# EAGLE design Project I (EAGLE 9.5.1)
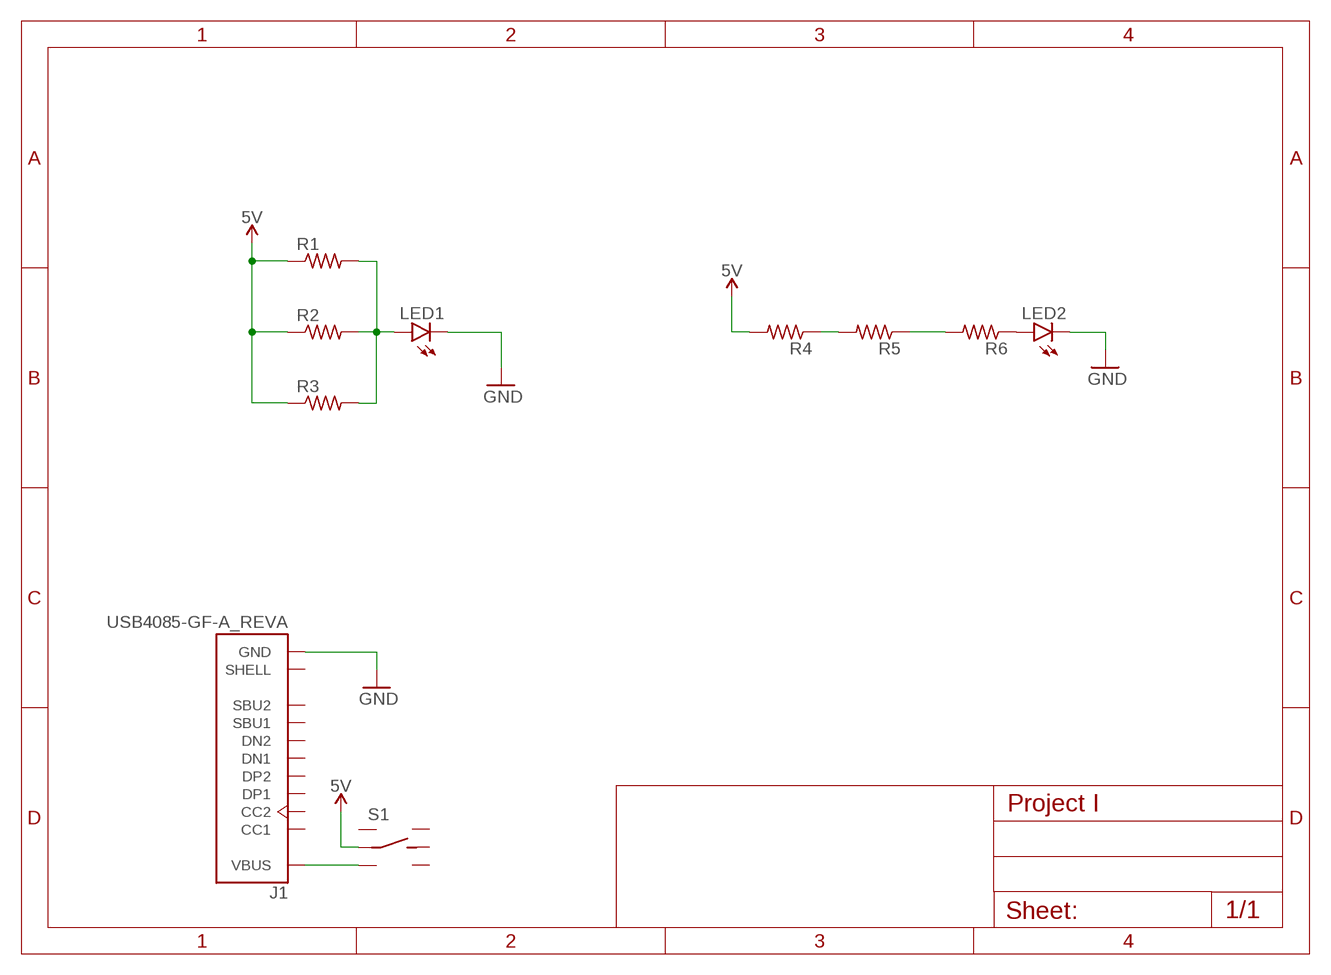
[diagram p0: schematic, sheet 1]

## Parts
J1  USB4085-GF-A_REVA  [GCT_USB4085-GF-A_REVA]
LED1  LED5MM  [LED5MM]
LED2  LED5MM  [LED5MM]
R1  R-US_0204/7  [0204/7]
R2  R-US_0204/7  [0204/7]
R3  R-US_0204/7  [0204/7]
R4  R-US_0204/7  [0204/7]
R5  R-US_0204/7  [0204/7]
R6  R-US_0204/7  [0204/7]
S1  DPDT_JS202011CQN  [DPDT_JS202011CQN]

## Nets
5V: R1.1 R2.1 R3.1 R4.2 S1.2(LC)
GND: J1.A1(GND) J1.A12(GND) J1.B1(GND) J1.B12(GND) LED1.K(C) LED2.K(C)
N$1: R4.1 R5.2
N$2: R5.1 R6.2
N$3: LED1.A R1.2 R2.2 R3.2
N$4: LED2.A R6.1
N$5: J1.A4(VBUS) J1.A9(VBUS) J1.B4(VBUS) J1.B9(VBUS) S1.3(L2)
Unconnected: J1.A5(CC1) J1.A6(DP1) J1.A7(DN1) J1.A8(SBU1) J1.B5(CC2) J1.B6(DP2) J1.B7(DN2) J1.B8(SBU2) J1.P1(SHELL) J1.P2(SHELL) J1.P3(SHELL) J1.P4(SHELL) S1.1(L1) S1.4(R1) S1.5(RC) S1.6(R2)

## Library data of the parts
J1 = SpaceDIY_connectors:USB4085-GF-A_REVA
LED1 LED2 = led:LED: LED OSRAM: - CHIPLED LG R971, LG N971, LY N971, LG Q971, LY Q971, LO R971, LY R971 LH N974, LH R974 LS Q976, LO Q976, LY Q976 LO Q996 - Hyper CHIPLED LW Q18S LB Q993, LB Q99A, LB R99A - SideLED LS A670, LO A670, LY A670, LG A670, LP A670 LB A673, LV A673, LT A673, LW A673 LH A674 LY A675 LS A676, LA A676, LO A676, LY A676, LW A676 LS A679, LY A679, LG A679 - Hyper Micro SIDELED® LS Y876, LA Y876, LO Y876, LY Y876 LT Y87S - SmartLED LW L88C, LW L88S LB L89C, LB L89S, LG L890 LS L89K, LO L89K, LY L89K LS L896, LA L896, LO L896, LY L896 - TOPLED LS T670, LO T670, LY T670, LG T670, LP T670 LSG T670, LSP T670, LSY T670, LOP T670, LYG T670 LG T671, LOG T671, LSG T671 LB T673, LV T673, LT T673, LW T673 LH T674 LS T676, LA T676, LO T676, LY T676, LB T676, LH T676, LSB T676, LW T676 LB T67C, LV T67C, LT T67C, LS T67K, LO T67K, LY T67K, LW E67C LS E67B, LA E67B, LO E67B, LY E67B, LB E67C, LV E67C, LT E67C LW T67C LS T679, LY T679, LG T679 LS T770, LO T770, LY T770, LG T770, LP T770 LB T773, LV T773, LT T773, LW T773 LH T774 LS E675, LA E675, LY E675, LS T675 LS T776, LA T776, LO T776, LY T776, LB T776 LHGB T686 LT T68C, LB T68C - Hyper Mini TOPLED® LB M676 - Mini TOPLED Santana® LG M470 LS M47K, LO M47K, LY M47K Source: http://www.osram.convergy.de LUXEON: - LUMILED® LXK2-PW12-R00, LXK2-PW12-S00, LXK2-PW14-U00, LXK2-PW14-V00 LXK2-PM12-R00, LXK2-PM12-S00, LXK2-PM14-U00 LXK2-PE12-Q00, LXK2-PE12-R00, LXK2-PE12-S00, LXK2-PE14-T00, LXK2-PE14-U00 LXK2-PB12-K00, LXK2-PB12-L00, LXK2-PB12-M00, LXK2-PB14-N00, LXK2-PB14-P00, LXK2-PB14-Q00 LXK2-PR12-L00, LXK2-PR12-M00, LXK2-PR14-Q00, LXK2-PR14-R00 LXK2-PD12-Q00, LXK2-PD12-R00, LXK2-PD12-S00 LXK2-PH12-R00, LXK2-PH12-S00 LXK2-PL12-P00, LXK2-PL12-Q00, LXK2-PL12-R00 Source: www.luxeon.com KINGBRIGHT: KA-3528ASYC Source: www.kingbright.com
R1-R6 = rcl:R-US_: RESISTOR, American symbol; SPICEPREFIX: R
S1 = bt_electromech:DPDT: Dual Position, Dual Throw (DPDT) Switch

## Board
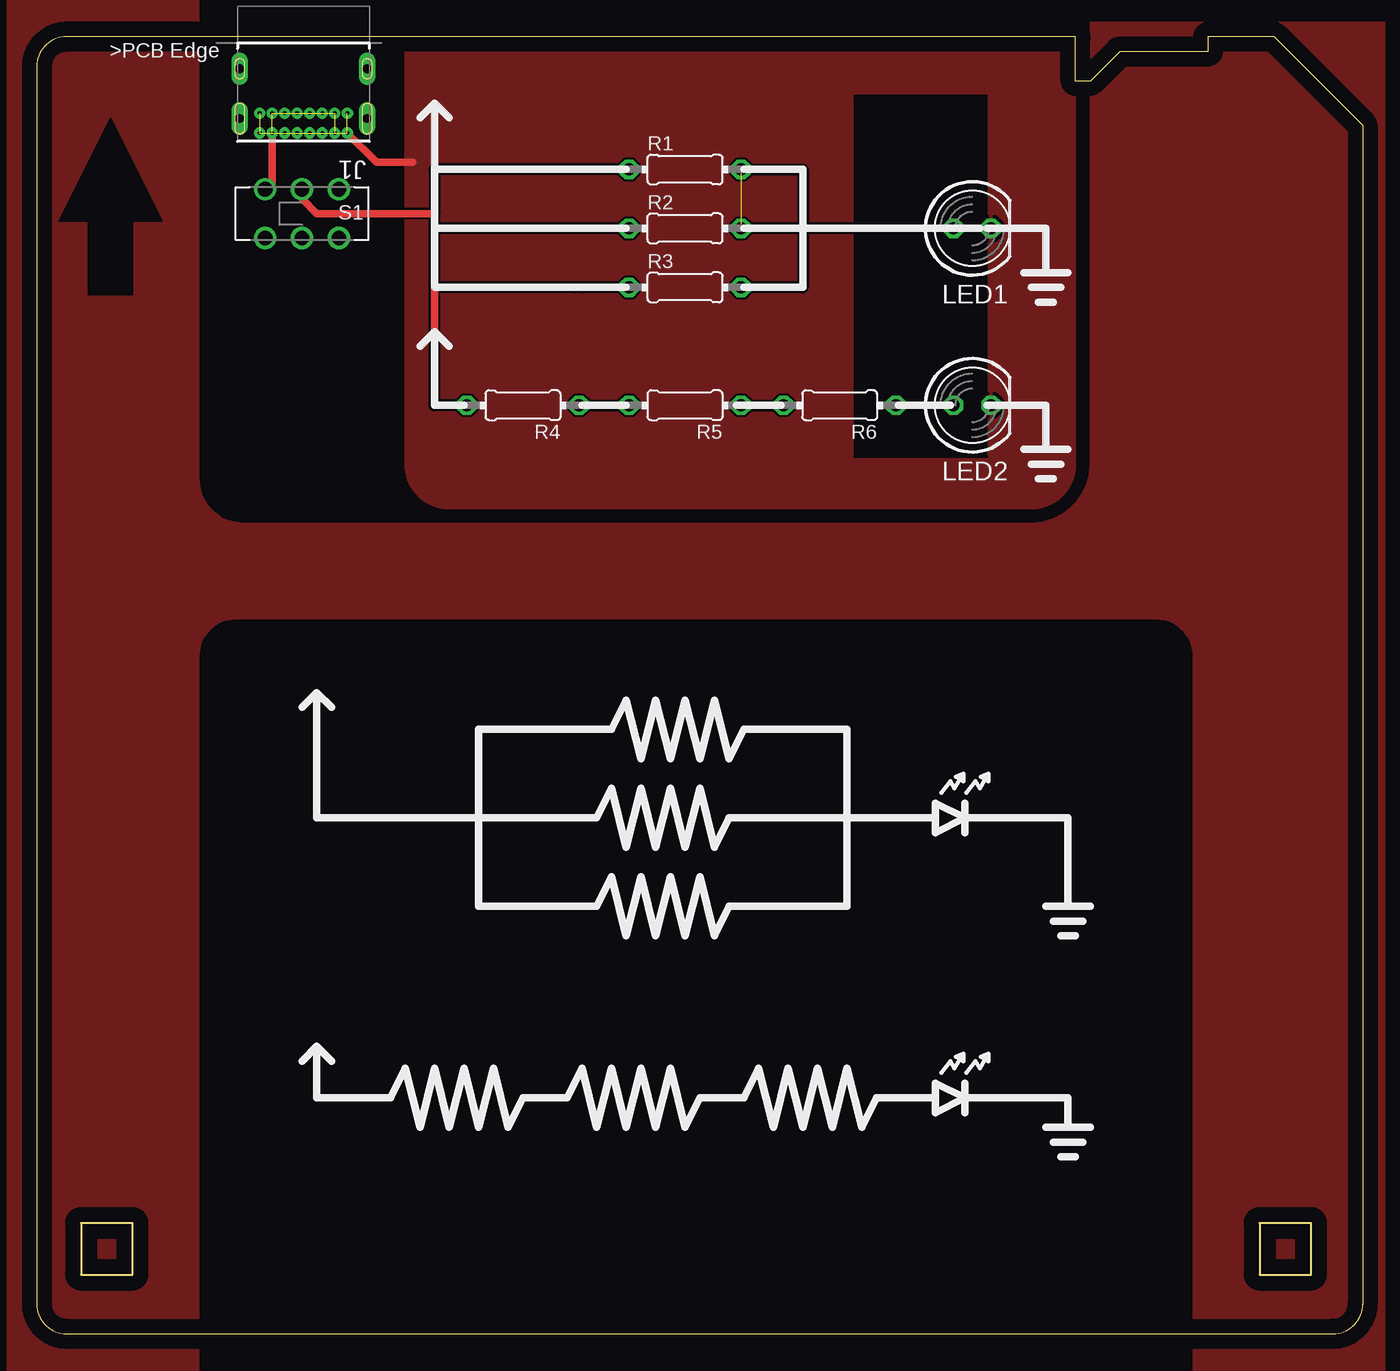
[diagram p1: board, top side]
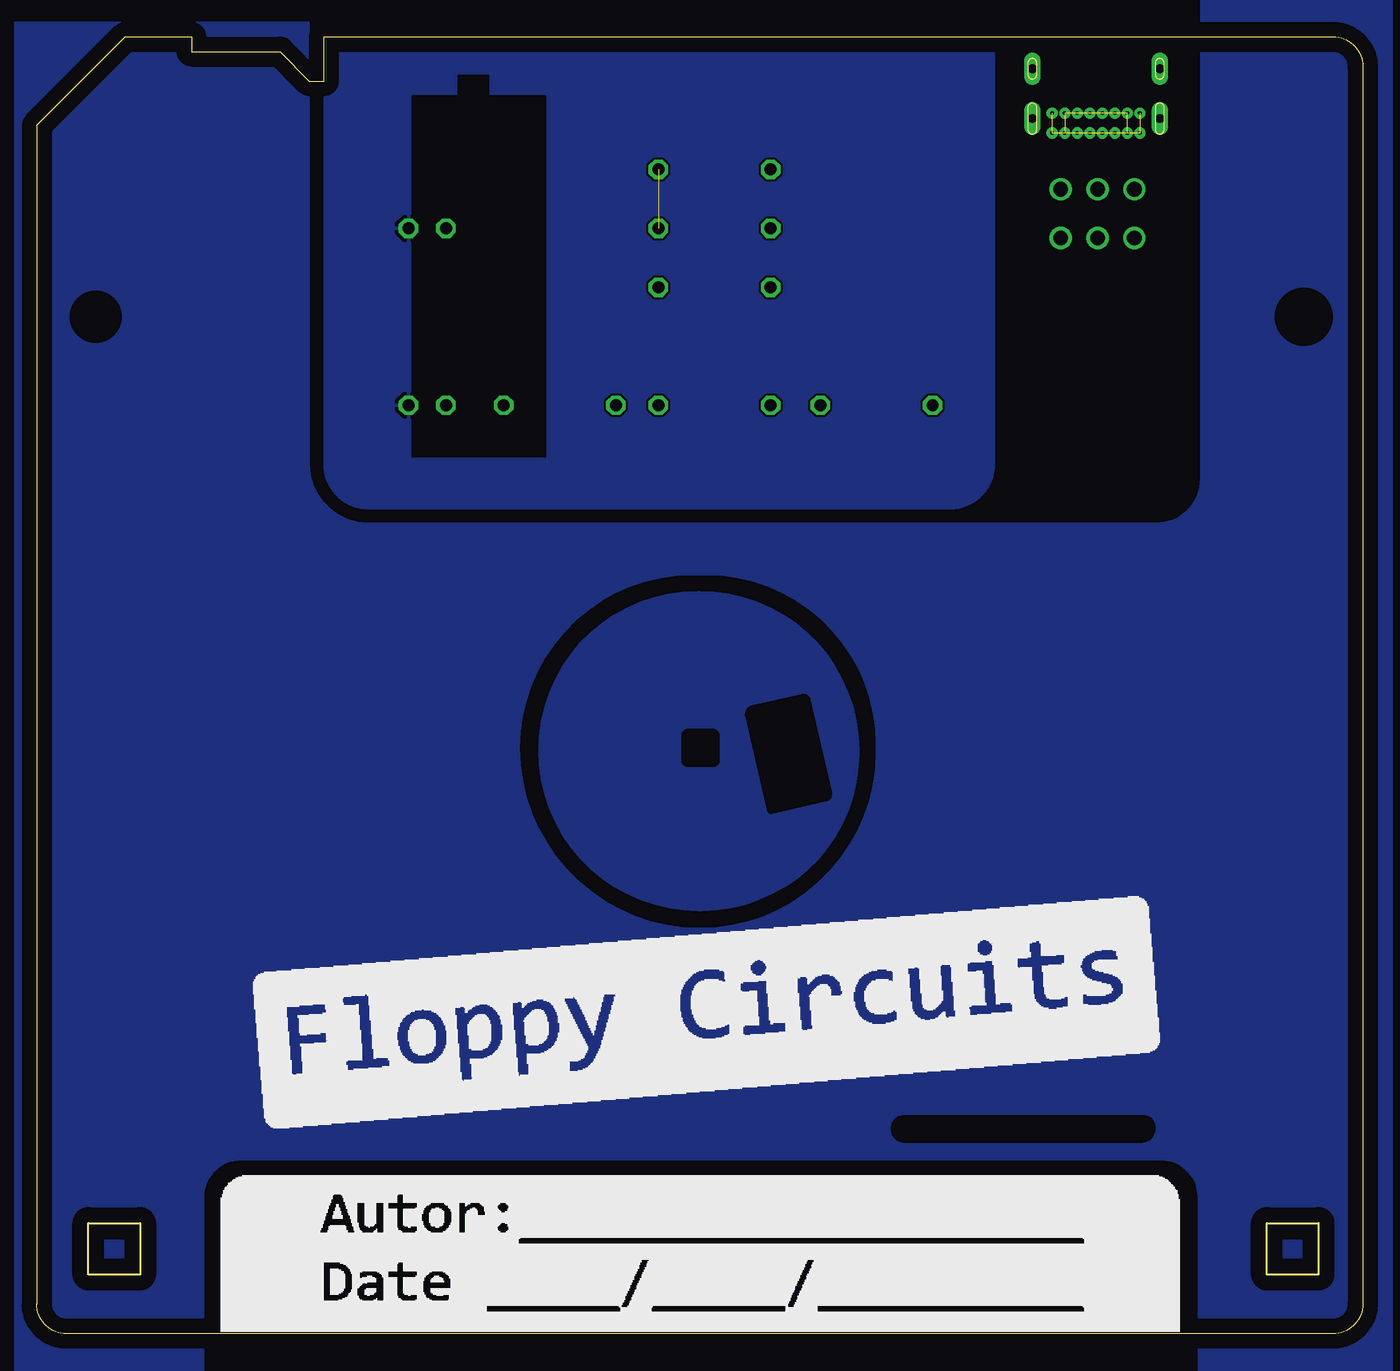
[diagram p2: board, bottom side, seen from below]

Size 90 x 88 mm. Coordinates in mm from the lower left corner, seen from the top.
Outline: 0,2 arc90 2,0 88,0 arc90 90,2 90,82 84,88 79.5,88 79.5,87 73.5,87 71.5,85 70.5,85 70.5,88 2,88 arc90 0,86 0,2
Outline: 3,4 6.5,4 6.5,7.5 3,7.5 3,4
Outline: 83,4 86.5,4 86.5,7.5 83,7.5 83,4
Copper layers (1*16): Top 0.035mm / dielectric 1.5mm / Bottom 0.035mm
Design rules "default *": minimum track width 6mil, minimum drill 0.35mm, track to track 6mil, track to pad 30mil, pad to pad 6mil, via to via 6mil, smd to smd 6mil, copper to edge 40mil, drill to drill 6mil, minimum pad ring 10mil, minimum via ring 8mil, stop-mask expansion 4mil, vias tented up to drill 0mil, thermal gap 10mil
tRestrict: area 55.5,59.5 to 64.5,84; area 1.5,70.5 to 8.5,82.5
bRestrict: area 55.5,59.5 to 64.5,85.4; area 36.1,35.3 to 41.9,43.4; area 43.7,38.5 to 46.2,41; area 14.1,13 to 32,14.8; area 3.3,68.3 to 4.7,69.7; area 85.5,68.5 to 86.5,69.5

### Footprints (pad centres in the part's own frame; a part is rotated, then mirrored left to right if it is on the bottom)
GCT_USB4085-GF-A_REVA = drill 0.25 pad 0.65: A1 -2.975,4.025; A4 -2.125,4.025; A5 -1.275,4.025; A6 -0.425,4.025; A7 0.425,4.025; A8 1.275,4.025; A9 2.125,4.025; A12 2.975,4.025; B1 2.975,2.675; B4 2.125,2.675; B5 1.275,2.675; B6 0.425,2.675; B7 -0.425,2.675; B8 -1.275,2.675; B9 -2.125,2.675; B12 -2.975,2.675 | drill 0.6 pad 1.108 long: P1 -4.325,3.045; P2 4.325,3.045; P3 4.325,-0.335; P4 -4.325,-0.335
LED5MM = drill 0.813 octagon: A -1.27,0; K 1.27,0
0204/7 = drill 0.813 octagon: 1 -3.81,0; 2 3.81,0
DPDT_JS202011CQN = drill 1: 1 -2.5,-1.65; 2 0,-1.651; 3 2.5,-1.65; 4 -2.5,1.65; 5 0,1.651; 6 2.5,1.65

### Placement (x,y rotation side)
J1  18.1,85.5 180 top
LED1  63.5,75 0 top
LED2  63.5,63 0 top
R1  44,79 0 top
R2  44,75 0 top
R3  44,71 0 top
R4  33,63 180 top
R5  44,63 180 top
R6  54.5,63 180 top
S1  18,76 180 top
U$1  [GND]  70,29 0 top
U$2  [VCC]  19,42 0 top
U$3  [LED]  62,35 0 top
U$4  [RESISTOR]  37,35 0 top
U$5  [GND]  70,14 0 top
U$6  [VCC]  19,18 0 top
U$7  [RESISTOR]  38,41 0 top
U$8  [RESISTOR]  37,29 0 top
U$9  [RESISTOR]  23,16 0 top
U$10  [RESISTOR]  35,16 0 top
U$11  [RESISTOR]  47,16 0 top
U$12  [LED]  62,16 0 top

### Tracks (layer width: path | path; a pad name or v marks a point on that pad's centre or on a via)
5V
  Top 0.508: S1.2 18,77 19,76 27,76 | R3.1 37,71 36.5,71 27,71 | R4.2 27,63 27,71 | 27,71 27,75 | 27,75 27,76 | R1.1 27,79 27,76 | R2.1 27,75
GND  (3 unrouted)
  Top 0.508: J1.A1 23.05,79.5 25.5,79.5
  pour Top: 25,89 25,59 arc90 28,56 67.5,56 arc90 70.5,59 70.5,89
  pour Bottom: 70.5,89 70.5,59 arc-90 67.5,56 28,56 arc-90 25,59 25,89
GND_1
  pour Top: 11,92.5 11,58 arc90 14,55 67.5,55 arc90 71.5,59 71.5,89 91.5,89 91.5,-3 78.5,-3 78.5,46 arc90 76,48.5 13.5,48.5 arc90 11,46 11,-2.5 -2,-2.5 -2,92.5
  pour Bottom: 11,92.5 11,58 arc90 14,55 67.5,55 arc90 71.5,59 71.5,89 91.5,89 91.5,-3 78.67,-3 78.67,9.29 arc90 76.17,11.79 45,11.79 45,27.5 arc90 57.25,39.75 arc90 45.5,51.5 44.5,51.5 arc90 33,40 33,39.46 arc90 44.96,27.5 44.96,11.79 13.67,11.79 arc90 11.17,9.29 11.17,-2.5 -2,-2.5 -2,92.5
GND_2
  pour Bottom: 44.98,50.35 arc90 34.2,39.58 34.2,39.41 arc90 44.89,28.71 45.06,28.71 arc90 55.92,39.58 arc90 45.15,50.35
N$1
  Top 0.508: R4.1 R5.2
N$2
  Top 0.508: R5.1 R6.2
N$3  (1 unrouted)
  Top 0.508: LED1.A R2.2 | R1.2 52,79 52,71 R3.2
N$4
  Top 0.508: R6.1 LED2.A
N$5  (3 unrouted)
  Top 0.508: J1.A9 15.97,78.12 S1.3